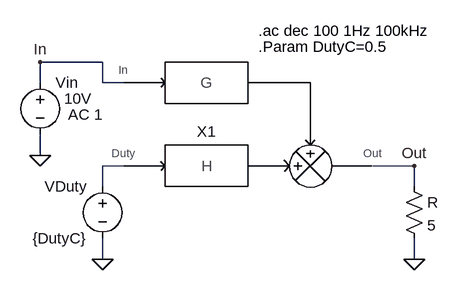
[diagram p0: schematic SchBlk-Buck-VM-Input Rejection Open.asc]
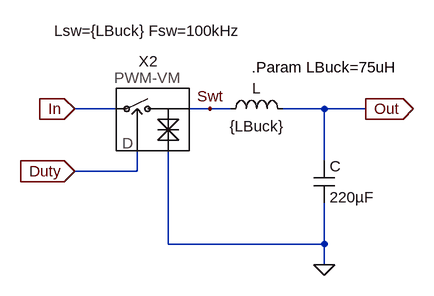
[diagram p1: sub-circuit buck-vm-power_train.asc]
SchBlk-Buck-VM-Input Rejection Open.asc, the LTspice schematic file:
Version 4
SHEET 1 880 696
WIRE 64 80 -32 80
WIRE -32 112 -32 80
WIRE 64 112 64 80
WIRE 96 112 64 112
WIRE -32 224 -32 192
WIRE 96 240 64 240
WIRE 544 240 480 240
WIRE 64 272 64 240
WIRE 544 272 544 240
WIRE 64 384 64 352
WIRE 544 384 544 352
FLAG -32 80 In
FLAG 544 384 0
FLAG 544 240 Out
FLAG 64 384 0
FLAG -32 224 0
SYMBOL voltage -32 96 R0
WINDOW 123 43 65 Left 2
WINDOW 39 0 0 Left 2
WINDOW 3 37 40 Left 2
SYMATTR Value2 AC 1
SYMATTR Value 10V
SYMATTR InstName Vin
SYMBOL res 528 256 R0
SYMATTR InstName R
SYMATTR Value 5
SYMBOL voltage 64 256 M0
SYMATTR InstName VDuty
SYMATTR Value {DutyC}
SYMBOL Buck-VM-Power_Train 224 240 R0
SYMATTR InstName X1
TEXT 304 56 Left 2 !.Param DutyC=0.5
TEXT 304 32 Left 2 !.ac dec 100 1Hz 100kHz

buck-vm-power_train.asc, the sub-circuit schematic file:
Version 4
SHEET 1 880 696
WIRE 80 48 16 48
WIRE 224 48 192 48
WIRE 256 48 224 48
WIRE 400 48 336 48
WIRE 464 48 400 48
WIRE 400 128 400 48
WIRE 112 144 112 112
WIRE 112 144 16 144
WIRE 160 256 160 112
WIRE 400 256 400 192
WIRE 400 256 160 256
WIRE 400 288 400 256
FLAG 400 288 0
FLAG 16 48 In
IOPIN 16 48 In
FLAG 464 48 Out
IOPIN 464 48 Out
FLAG 224 48 Swt
FLAG 16 144 Duty
IOPIN 16 144 In
SYMBOL ind 240 64 R270
WINDOW 0 32 56 VTop 2
WINDOW 3 5 56 VBottom 2
SYMATTR InstName L
SYMATTR Value {LBuck}
SYMBOL cap 384 128 R0
SYMATTR InstName C
SYMATTR Value 220µF
SYMATTR SpiceLine Rser=70m
SYMBOL PWM-VM 128 64 R0
WINDOW 39 0 -112 Invisible 2
SYMATTR InstName X2
SYMATTR SpiceLine2 Lsw={LBuck} Fsw=100kHz
TEXT 288 -16 Left 2 !.Param LBuck=75uH

The netlist it stands for:
* SchBlk-Buck-VM-Input Rejection Open.asc
Vin In 0 10V AC 1
R Out 0 5
VDuty N001 0 {DutyC}
XX1 N001 In Out buck-vm-power_train

* block symbol definitions
.subckt buck-vm-power_train Duty In Out
L Swt Out {LBuck}
C Out 0 220µF Rser=70m
XX2 In Swt 0 Duty PWM-VM params: DCMin=0.05 DCMax=0.95 Lsw={LBuck} Fsw=100kHz  ; pins nA nC nP nD
.Param LBuck=75uH
.ends buck-vm-power_train

.Param DutyC=0.5
.ac dec 100 1Hz 100kHz
.backanno
.end